# EAGLE design Philip_Neill_Schaltung (EAGLE 8.1.0)
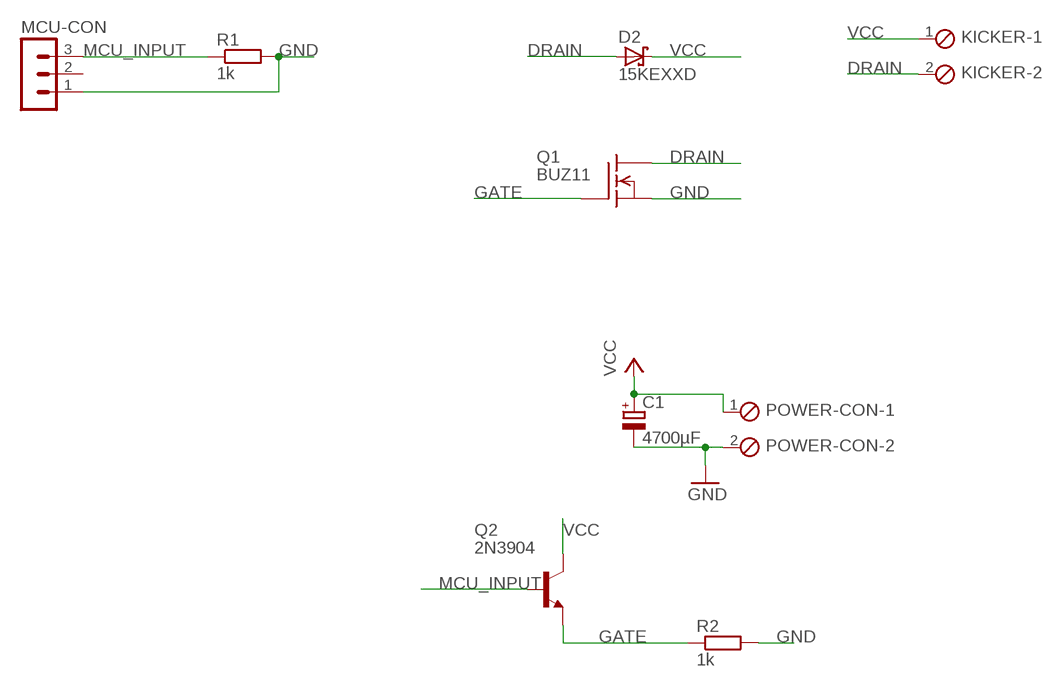
[diagram p0: schematic, sheet 1]

## Parts
C1  4700µF  CPOL-EUE10-20  [EB20D]
D2  15KEXXD  [DO201T15]
KICKER  MPT2  [2POL254]
MCU-CON  MA03-1  [MA03-1]
POWER-CON  MPT2  [2POL254]
Q1  BUZ11  [TO220]
Q2  2N3904  [TO92]
R1  1k  R-EU_0207/7  [0207/7]
R2  1k  R-EU_0207/7  [0207/7]

## Nets
DRAIN: D2.A KICKER.2 Q1.2(D)
GATE: Q1.1(G) Q2.3(E) R2.1
GND: C1.- MCU-CON.1 POWER-CON.2 Q1.3(S) R1.2 R2.2
MCU_INPUT: MCU-CON.3 Q2.2(B) R1.1
VCC: C1.+ D2.C KICKER.1 POWER-CON.1 Q2.1(C)
Unconnected: MCU-CON.2

## Library data of the parts
C1 = resistor:CPOL-EU: POLARIZED CAPACITOR, European symbol
D2 = diode:15KEXXD: DIODE
KICKER POWER-CON = con-phoenix-254:MPT2: PHOENIX CONNECTOR; OC_FARNELL: unknown; OC_NEWARK: unknown
MCU-CON = con-lstb:MA03-1: PIN HEADER; OC_FARNELL: unknown; OC_NEWARK: unknown
Q1 = transistor-fet:BUZ11: N-Channel Enhancement MOSFET 50V; 30A; 0,040Ohm
Q2 = transistor-npn:2N3904: NPN Transistor
R1 R2 = resistor:R-EU_: RESISTOR, European symbol

## Board
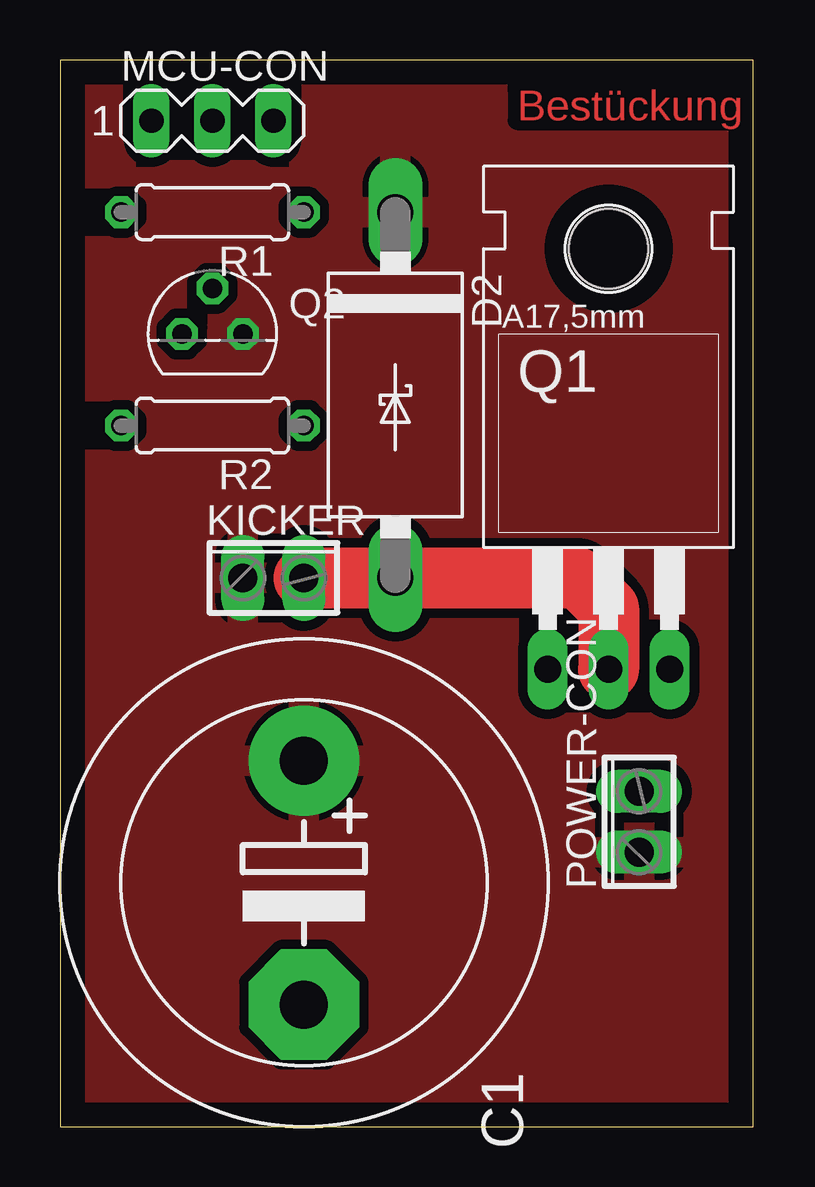
[diagram p1: board, top side]
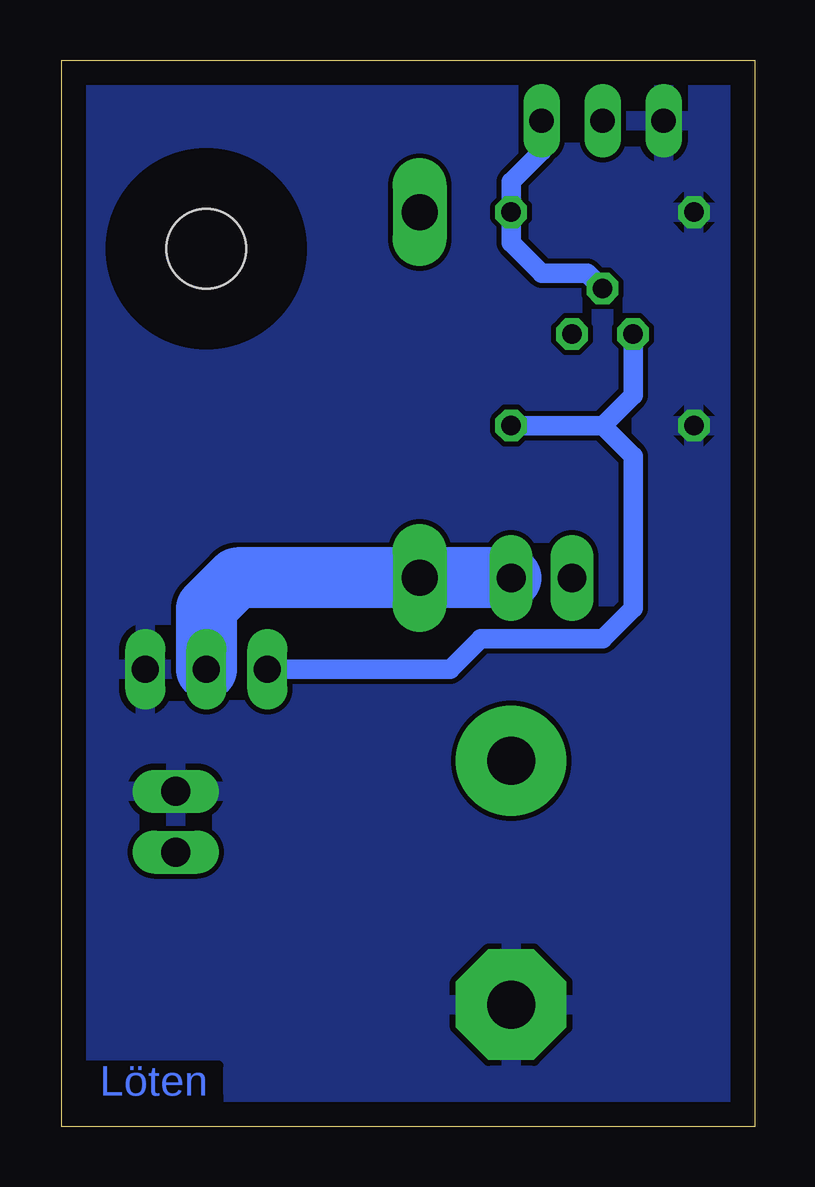
[diagram p2: board, bottom side, seen from below]

Size 28.88 x 44.44 mm. Coordinates in mm from the lower left corner, seen from the top.
Outline: 0,0 28.88,0 28.88,44.44 0,44.44 0,0
Copper layers (1*16): Top 0.035mm / dielectric 1.5mm / Bottom 0.035mm
Design rules "default": minimum track width 10mil, minimum drill 24mil, track to track 8mil, track to pad 8mil, pad to pad 8mil, via to via 8mil, smd to smd 8mil, copper to edge 40mil, drill to drill 8mil, minimum pad ring 10mil, minimum via ring 8mil, stop-mask expansion 4mil, vias tented up to drill 0mil, thermal gap 10mil

### Footprints (pad centres in the part's own frame; a part is rotated, then mirrored left to right if it is on the bottom)
EB20D = drill 2.007 pad 4.597: + -5.08,0 | drill 2.007 pad 4.597 octagon: - 5.08,0
DO201T15 = drill 1.499 long: A 7.62,0; C -7.62,0
2POL254 = drill 1.2 long: 1 -1.27,0; 2 1.27,0
MA03-1 = drill 1.016 long: 1 -2.54,0; 2 0,0; 3 2.54,0
TO220 = drill 1.118 long: 1 -2.54,-6.35; 2 0,-6.35; 3 2.54,-6.35 | hole 3.302: 0,11.176
TO92 = drill 0.813 octagon: 1 1.27,0; 2 0,1.905; 3 -1.27,0
0207/7 = drill 0.813 octagon: 1 -3.81,0; 2 3.81,0

### Placement (x,y rotation side)
C1  10.16,10.16 270 top
D2  13.97,30.48 270 top
KICKER  8.89,22.86 0 top
MCU-CON  6.35,41.91 0 top
POWER-CON  24.13,12.7 90 top
Q1  22.86,25.4 0 top
Q2  6.35,33.02 0 top
R1  6.35,38.1 180 top
R2  6.35,29.21 180 top

### Tracks (layer width: path | path; a pad name or v marks a point on that pad's centre or on a via)
DRAIN
  Top 2.54: KICKER.2 D2.A 21.59,22.86 22.86,21.59 Q1.2
  Bottom 2.54: KICKER.2 D2.A 21.59,22.86 22.86,21.59 Q1.2
GATE
  Bottom 0.813: Q2.3 5.08,30.48 6.35,29.21 | 6.35,29.21 R2.1 | 6.35,29.21 5.08,27.94 5.08,21.59 6.35,20.32 11.43,20.32 12.7,19.05 Q1.1
GND
  pour Bottom: 0.64,43.82 27.94,43.82 27.94,0.64 0.64,0.64
MCU_INPUT
  Bottom 0.813: MCU-CON.3 8.89,40.64 10.16,39.37 R1.1 10.16,36.83 8.89,35.56 6.98,35.56 Q2.2
VCC
  pour Top (isolate 0.4): 1.27,43.18 1.27,1.27 27.94,1.27 27.94,43.18

### Text on the board
Top: Bestückung
Bottom: Löten